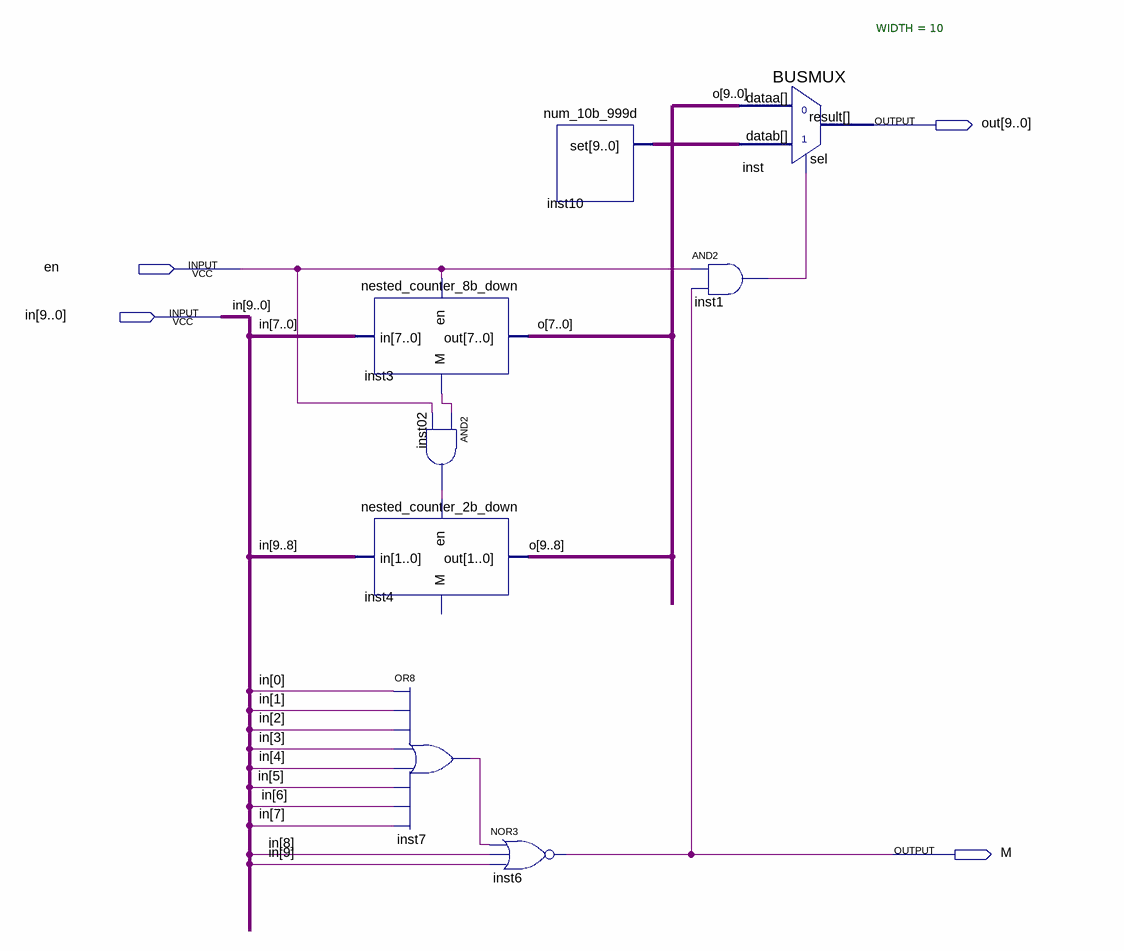
[diagram p0: schematic sheet]
// Quartus schematic nested_counter_kd_down.bdf as structural Verilog: 8 symbols, 4 pins
module nested_counter_kd_down (
  input  en,
  input  [9:0] in,
  output [9:0] out,
  output M
);

  wire inst1_out, inst02_out, inst3_m, inst7_out;
  wire [9:0] inst10_set, o;

  nested_counter_8b_down inst3 (.en(en), .in(in[7:0]), .out(o[7:0]), .M(inst3_m));
  and inst02 (inst02_out, inst3_m, en);
  nested_counter_2b_down inst4 (.en(inst02_out), .in(in[9:8]), .out(o[9:8]));  // open: M
  or inst7 (inst7_out, in[0], in[1], in[2], in[3], in[4], in[5], in[6], in[7]);
  nor inst6 (M, inst7_out, in[8], in[9]);
  num_10b_999d inst10 (.set(inst10_set));
  and inst1 (inst1_out, en, M);
  BUSMUX #(.WIDTH(10)) inst (.datab(inst10_set), .sel(inst1_out), .dataa(o), .result(out));
endmodule
